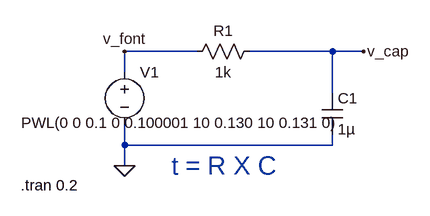
[diagram p0: schematic rc.asc]
rc.asc, the LTspice schematic file:
Version 4
SHEET 1 880 680
WIRE -112 64 -224 64
WIRE 96 64 -32 64
WIRE 144 64 96 64
WIRE -224 96 -224 64
WIRE 96 128 96 64
WIRE -224 208 -224 176
WIRE 96 208 96 192
WIRE 96 208 -224 208
WIRE -224 240 -224 208
FLAG -224 240 0
FLAG 144 64 v_cap
FLAG -224 64 v_font
SYMBOL cap 80 128 R0
SYMATTR InstName C1
SYMATTR Value 1µ
SYMBOL res -16 48 R90
WINDOW 0 0 56 VBottom 2
WINDOW 3 32 56 VTop 2
SYMATTR InstName R1
SYMATTR Value 1k
SYMBOL voltage -224 80 R0
WINDOW 3 -159 94 Left 2
WINDOW 123 0 0 Left 0
WINDOW 39 0 0 Left 0
SYMATTR InstName V1
SYMATTR Value PWL(0 0 0.1 0 0.100001 10 0.130 10 0.131 0)
TEXT -152 240 Left 4 ;t = R X C
TEXT -384 270 Left 2 !.tran 0.2

The netlist it stands for:
* rc.asc
C1 v_cap 0 1µ
R1 v_cap v_font 1k
V1 v_font 0 PWL(0 0 0.1 0 0.100001 10 0.130 10 0.131 0)
* t = R X C
.tran 0.2
.backanno
.end